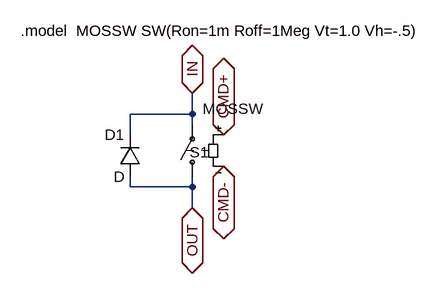
[diagram p0: schematic switch-mos.asc]
switch-mos.asc, the LTspice schematic file:
Version 4
SHEET 1 880 680
WIRE 160 112 160 80
WIRE 160 112 64 112
WIRE 160 128 160 112
WIRE 64 144 64 112
WIRE 64 224 64 208
WIRE 160 224 160 208
WIRE 160 224 64 224
WIRE 160 256 160 224
FLAG 208 144 CMD+
IOPIN 208 144 BiDir
FLAG 208 192 CMD-
IOPIN 208 192 BiDir
FLAG 160 80 IN
IOPIN 160 80 BiDir
FLAG 160 256 OUT
IOPIN 160 256 BiDir
SYMBOL sw 160 224 R180
WINDOW 0 -25 53 Left 2
WINDOW 3 -109 120 Left 2
SYMATTR InstName S1
SYMATTR Value MOSSW
SYMBOL diode 80 208 R180
WINDOW 0 24 64 Left 2
WINDOW 3 24 0 Left 2
SYMATTR InstName D1
TEXT -104 -16 Left 2 !.model  MOSSW SW(Ron=1m Roff=1Meg Vt=1.0 Vh=-.5)

The netlist it stands for:
* switch-mos.asc
S1 OUT IN CMD+ CMD- MOSSW
D1 OUT IN D
.model D D
.lib standard.dio
.model  MOSSW SW(Ron=1m Roff=1Meg Vt=1.0 Vh=-.5)
.backanno
.end